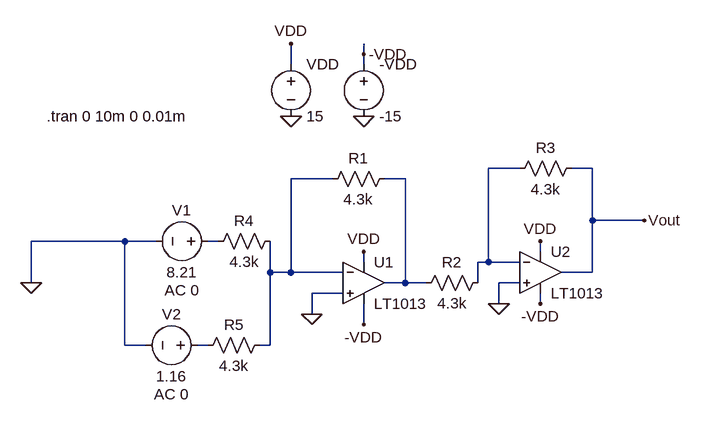
[diagram p0: schematic Adder_Circuit.asc]
Adder_Circuit.asc, the LTspice schematic file:
Version 4.1
SHEET 1 880 680
WIRE 128 32 128 16
WIRE 16 48 16 16
WIRE 128 48 128 32
WIRE 368 208 320 208
WIRE 480 208 448 208
WIRE 80 224 16 224
WIRE 192 224 160 224
WIRE 480 288 480 208
WIRE 560 288 480 288
WIRE -240 320 -384 320
WIRE -192 320 -240 320
WIRE -96 320 -112 320
WIRE 400 336 400 320
WIRE 128 352 128 336
WIRE 320 352 320 208
WIRE 320 352 304 352
WIRE 368 352 320 352
WIRE -16 368 -16 320
WIRE 16 368 16 224
WIRE 16 368 -16 368
WIRE 96 368 16 368
WIRE 480 368 480 288
WIRE 480 368 432 368
WIRE -384 384 -384 320
WIRE 192 384 192 224
WIRE 192 384 160 384
WIRE 224 384 192 384
WIRE 304 384 304 352
WIRE 368 384 336 384
WIRE 96 400 48 400
WIRE 336 416 336 384
WIRE 400 416 400 400
WIRE 48 432 48 400
WIRE 128 448 128 416
WIRE -240 480 -240 320
WIRE -208 480 -240 480
WIRE -112 480 -128 480
WIRE -16 480 -16 368
WIRE -16 480 -32 480
FLAG 16 128 0
FLAG 128 128 0
FLAG -384 384 0
FLAG 400 320 VDD
FLAG 400 416 -VDD
FLAG 48 432 0
FLAG 336 416 0
FLAG 560 288 Vout
FLAG 128 336 VDD
FLAG 128 448 -VDD
FLAG 16 16 VDD
FLAG 128 32 -VDD
SYMBOL voltage -96 320 R90
WINDOW 0 -32 56 VBottom 2
WINDOW 3 32 56 VTop 2
WINDOW 123 60 56 VTop 2
WINDOW 39 0 0 Left 0
SYMATTR InstName V1
SYMATTR Value 8.21
SYMATTR Value2 AC 0
SYMBOL voltage -112 480 R90
WINDOW 0 -32 56 VBottom 2
WINDOW 3 32 56 VTop 2
WINDOW 123 60 56 VTop 2
WINDOW 39 0 0 Left 0
SYMATTR InstName V2
SYMATTR Value 1.16
SYMATTR Value2 AC 0
SYMBOL OpAmps\\LT1013 128 320 R0
SYMATTR InstName U1
SYMBOL OpAmps\\LT1013 400 304 R0
SYMATTR InstName U2
SYMBOL res 176 208 R90
WINDOW 0 0 56 VBottom 2
WINDOW 3 32 56 VTop 2
SYMATTR InstName R1
SYMATTR Value 4.3k
SYMBOL res 320 368 R90
WINDOW 0 0 56 VBottom 2
WINDOW 3 32 56 VTop 2
SYMATTR InstName R2
SYMATTR Value 4.3k
SYMBOL res 464 192 R90
WINDOW 0 0 56 VBottom 2
WINDOW 3 32 56 VTop 2
SYMATTR InstName R3
SYMATTR Value 4.3k
SYMBOL res 0 304 R90
WINDOW 0 0 56 VBottom 2
WINDOW 3 32 56 VTop 2
SYMATTR InstName R4
SYMATTR Value 4.3k
SYMBOL res -16 464 R90
WINDOW 0 0 56 VBottom 2
WINDOW 3 32 56 VTop 2
SYMATTR InstName R5
SYMATTR Value 4.3k
SYMBOL voltage 16 32 R0
SYMATTR InstName VDD
SYMATTR Value 15
SYMBOL voltage 128 32 R0
SYMATTR InstName -VDD
SYMATTR Value -15
TEXT -360 128 Left 2 !.tran 0 10m 0 0.01m

The netlist it stands for:
* Adder_Circuit.asc
V1 N004 0 8.21 AC 0
V2 N005 0 1.16 AC 0
X§U1 0 N002 VDD -VDD N003 LT1013  ; pins In+ In- V+ V- OUT
X§U2 0 N001 VDD -VDD Vout LT1013  ; pins In+ In- V+ V- OUT
R1 N003 N002 4.3k
R2 N001 N003 4.3k
R3 Vout N001 4.3k
R4 N002 N004 4.3k
R5 N002 N005 4.3k
VDD VDD 0 15
V§-VDD -VDD 0 -15
.tran 0 10m 0 0.01m
.lib LTC.lib
.backanno
.end